# EAGLE schematic QTouchShield (EAGLE 6.2)
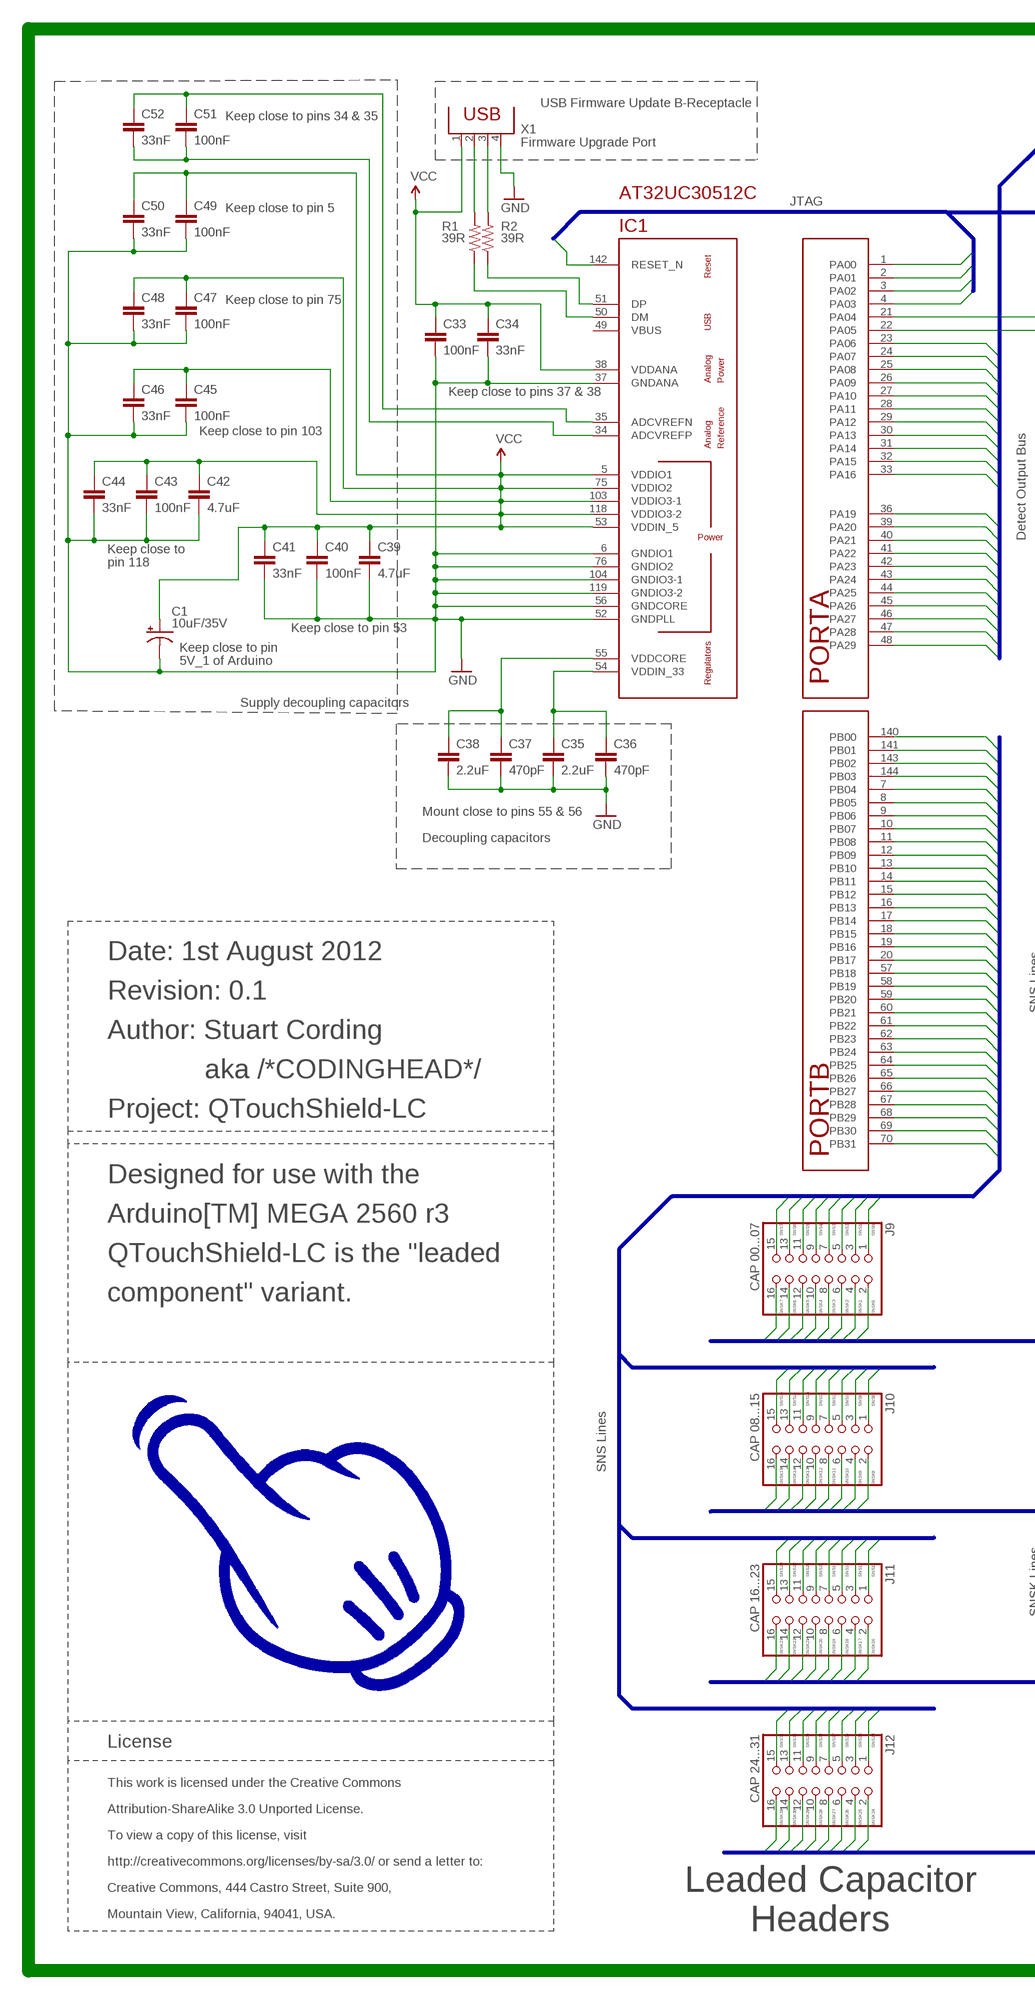
[diagram p0: schematic, sheet 1, part 1 of 2]
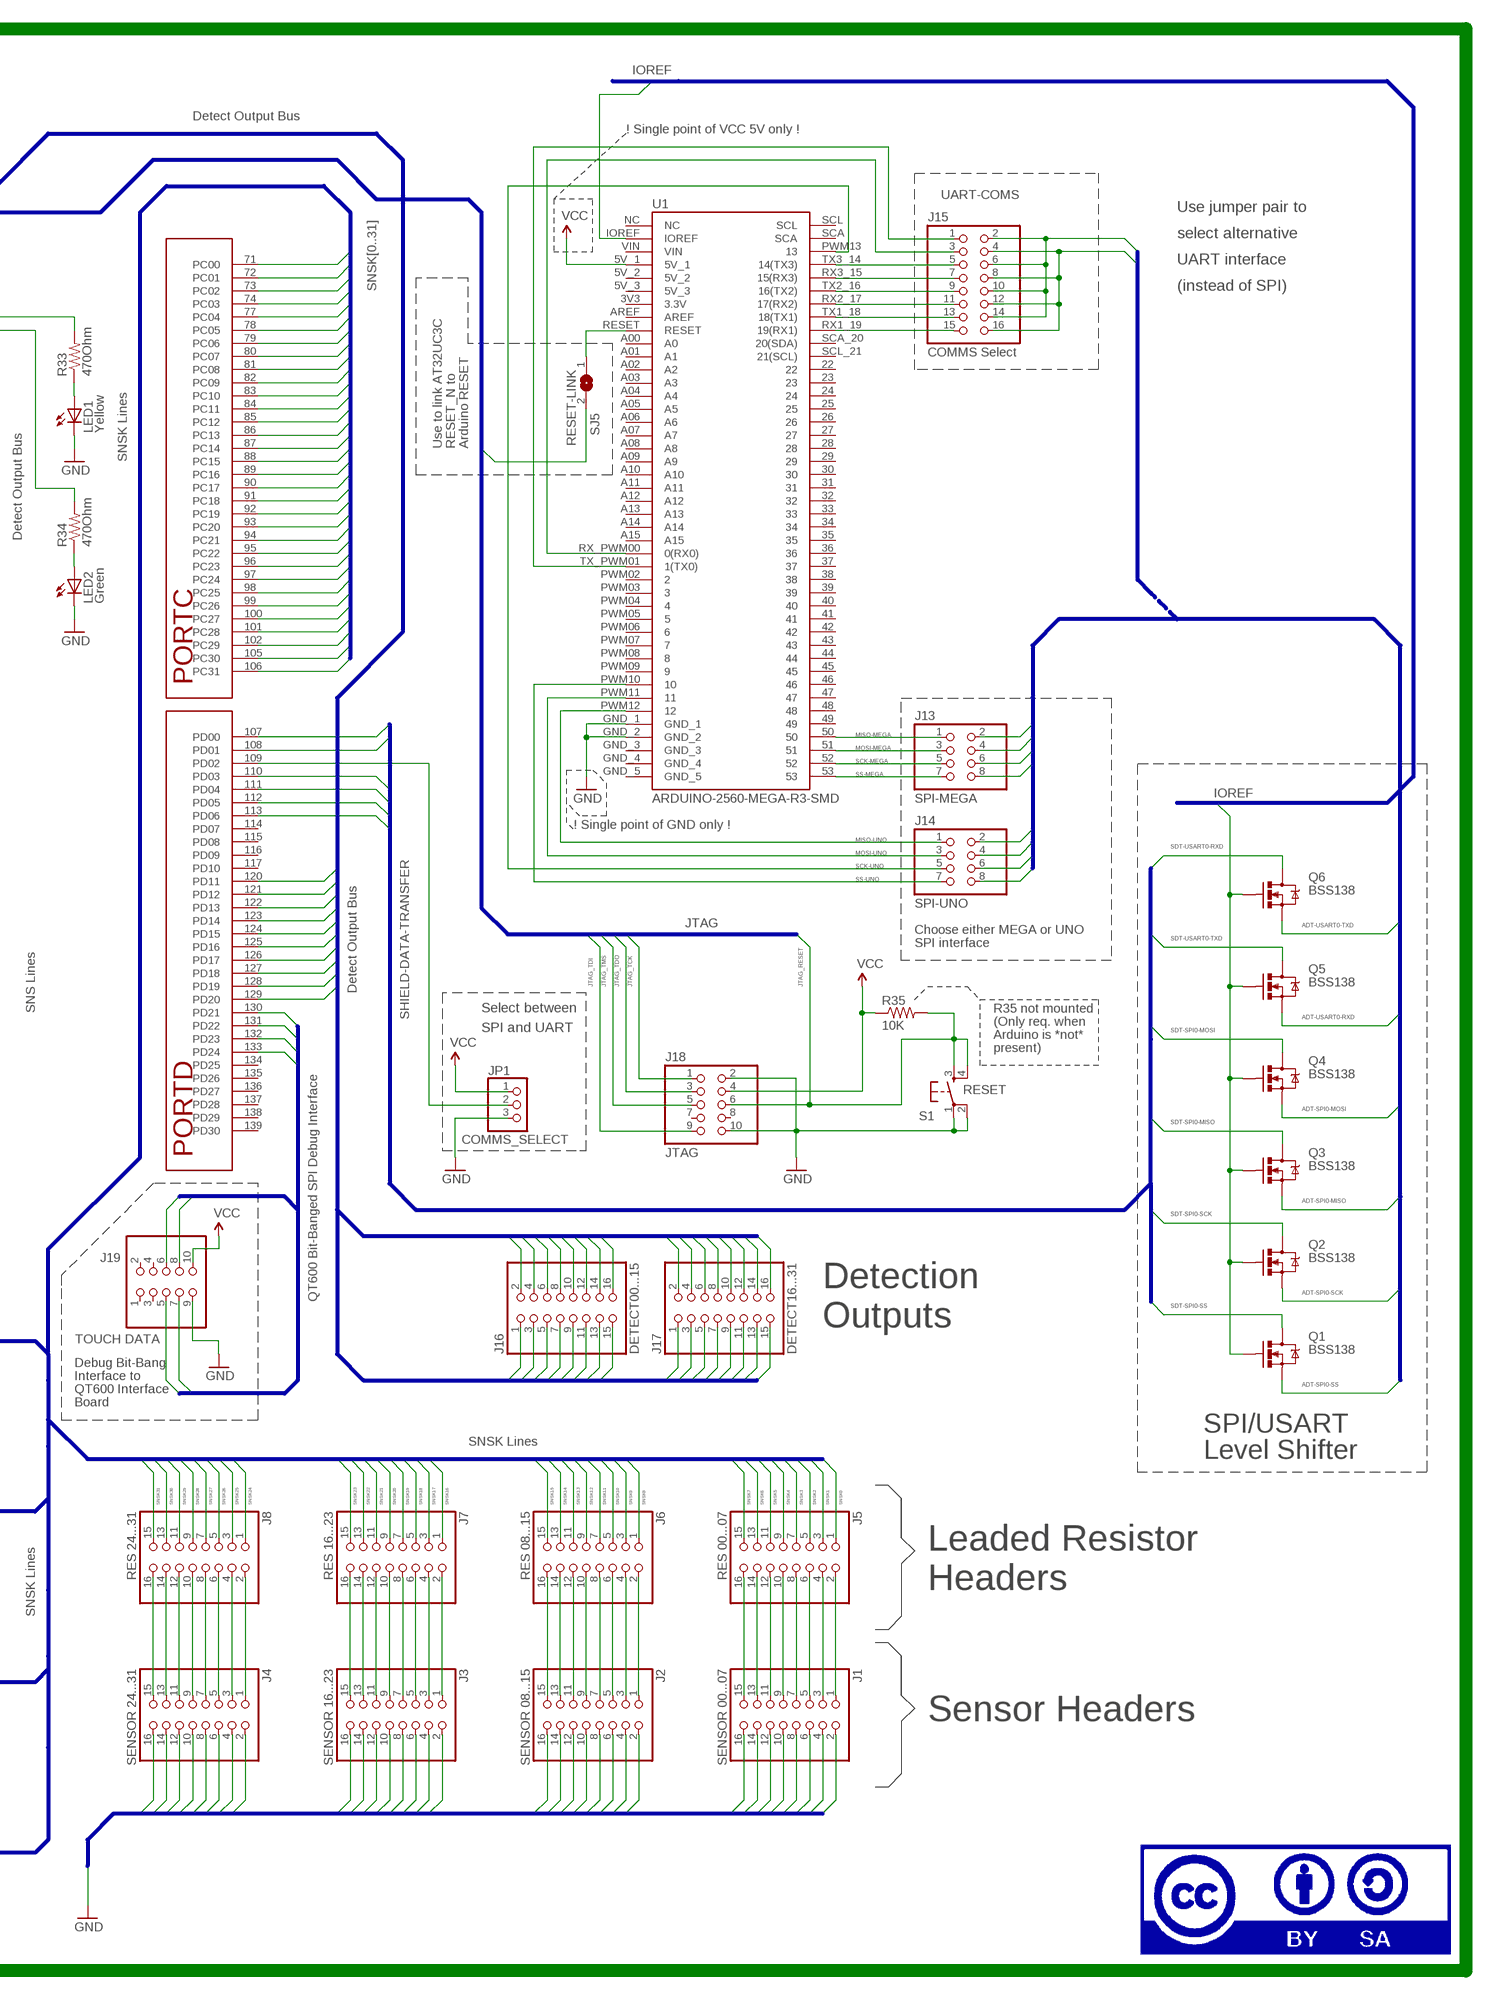
[diagram p1: schematic, sheet 1, part 2 of 2]

## Parts
C1  10uF/35V  CAP_POLC  [PANASONIC_C]
C33  100nF  CAP0805  [0805]
C34  33nF  CAP0805  [0805]
C35  2.2uF  CAP1210  [1210]
C36  470pF  CAP0805  [0805]
C37  470pF  CAP0805  [0805]
C38  2.2uF  CAP1210  [1210]
C39  4.7uF  CAP1210  [1210]
C40  100nF  CAP0805  [0805]
C41  33nF  CAP0805  [0805]
C42  4.7uF  CAP1210  [1210]
C43  100nF  CAP0805  [0805]
C44  33nF  CAP0805  [0805]
C45  100nF  CAP0805  [0805]
C46  33nF  CAP0805  [0805]
C47  100nF  CAP0805  [0805]
C48  33nF  CAP0805  [0805]
C49  100nF  CAP0805  [0805]
C50  33nF  CAP0805  [0805]
C51  100nF  CAP0805  [0805]
C52  33nF  CAP0805  [0805]
IC1  AT32UC3C0512CJEDEC-MS-026  [LQFP144]
J1  SENSOR 00...07  2X8-HEADERHARWIN-PIN-SMT  [2X8-V-MALE-SMT-HARWIN]
J2  SENSOR 08...15  2X8-HEADERHARWIN-PIN-SMT  [2X8-V-MALE-SMT-HARWIN]
J3  SENSOR 16...23  2X8-HEADERHARWIN-PIN-SMT  [2X8-V-MALE-SMT-HARWIN]
J4  SENSOR 24...31  2X8-HEADERHARWIN-PIN-SMT  [2X8-V-MALE-SMT-HARWIN]
J5  RES 00...07  2X8-HEADERHARWIN-RECEPTACLE-SMT  [2X8-V-FEMALE-SMT-HARWIN]
J6  RES 08...15  2X8-HEADERHARWIN-RECEPTACLE-SMT  [2X8-V-FEMALE-SMT-HARWIN]
J7  RES 16...23  2X8-HEADERHARWIN-RECEPTACLE-SMT  [2X8-V-FEMALE-SMT-HARWIN]
J8  RES 24...31  2X8-HEADERHARWIN-RECEPTACLE-SMT  [2X8-V-FEMALE-SMT-HARWIN]
J9  CAP 00...07  2X8-HEADERHARWIN-RECEPTACLE-SMT  [2X8-V-FEMALE-SMT-HARWIN]
J10  CAP 08...15  2X8-HEADERHARWIN-RECEPTACLE-SMT  [2X8-V-FEMALE-SMT-HARWIN]
J11  CAP 16...23  2X8-HEADERHARWIN-RECEPTACLE-SMT  [2X8-V-FEMALE-SMT-HARWIN]
J12  CAP 24...31  2X8-HEADERHARWIN-RECEPTACLE-SMT  [2X8-V-FEMALE-SMT-HARWIN]
J13  SPI-MEGA  2X4-HEADERSMT-MALE  [2X4-V-MALE-SMT-HARWIN]
J14  SPI-UNO  2X4-HEADERSMT-MALE  [2X4-V-MALE-SMT-HARWIN]
J15  COMMS Select  2X8-HEADERHARWIN-PIN-SMT  [2X8-V-MALE-SMT-HARWIN]
J16  DETECT00...15  2X8-HEADERHARWIN-PIN-SMT  [2X8-V-MALE-SMT-HARWIN]
J17  DETECT16...31  2X8-HEADERHARWIN-PIN-SMT  [2X8-V-MALE-SMT-HARWIN]
J18  JTAG  2X5-HEADERSMT  [2X5-V-MALE-SMT-HARWIN]
J19  TOUCH DATA  2X5-HEADERSMT  [2X5-V-MALE-SMT-HARWIN]
JP1  COMMS_SELECT  PINHD-1X3  [1X03]
LED1  Yellow  LED1206  [LED-1206]
LED2  Green  LED1206  [LED-1206]
Q1  BSS138  MOSFET-NCHANNELSMD  [SOT23-3]
Q2  BSS138  MOSFET-NCHANNELSMD  [SOT23-3]
Q3  BSS138  MOSFET-NCHANNELSMD  [SOT23-3]
Q4  BSS138  MOSFET-NCHANNELSMD  [SOT23-3]
Q5  BSS138  MOSFET-NCHANNELSMD  [SOT23-3]
Q6  BSS138  MOSFET-NCHANNELSMD  [SOT23-3]
R1  39R  RESISTOR0805-RES  [0805]
R2  39R  RESISTOR0805-RES  [0805]
R33  470Ohm  RESISTOR0805-RES  [0805]
R34  470Ohm  RESISTOR0805-RES  [0805]
R35  10K  RESISTOR0805-RES  [0805]
S1  RESET  TAC_SWITCHSMD  [TACTILE_SWITCH_SMD]
SJ5  RESET-LINK  SJ  [SJ]
U1  ARDUINO-2560-MEGA-R3-SMD  ARDUINO-2560-MEGA-R3SMDSMD-BOTTOM  [ARDUINO-2560-R3-SMD]
X1  Firmware Upgrade Port  PN87520  [PN87520]

## Nets
ADCVREFN: C51.1 C52.1 IC1.35(ADCVREFN)
ADCVREFP: C51.2 C52.2 IC1.34(ADCVREFP)
ADT-SPI0-MISO: J13.2 J14.2 Q3.2(S)
ADT-SPI0-MOSI: J13.4 J14.4 Q4.2(S)
ADT-SPI0-SCK: J13.6 J14.6 Q2.2(S)
ADT-SPI0-SS: J13.8 J14.8 Q1.2(S)
ADT-USART0-RXD: J15.4 J15.8 J15.12 J15.16 Q5.2(S)
ADT-USART0-TXD: J15.2 J15.6 J15.10 J15.14 Q6.2(S)
ARDUINO_RESET: SJ5.1 U1.RESET
GND: C1.- C33.2 C34.2 C35.2 C36.2 C37.2 C38.2 C39.2 C40.2 C41.2 C42.2 C43.2 C44.2 C45.2 C46.2 C47.2 C48.2 C49.2 C50.2 IC1.6(GNDIO1) IC1.37(GNDANA) IC1.52(GNDPLL) IC1.56(GNDCORE) IC1.76(GNDIO2) IC1.104(GNDIO3-1) IC1.119(GNDIO3-2) J1.2 J1.4 J1.6 J1.8 J1.10 J1.12 J1.14 J1.16 J2.2 J2.4 J2.6 J2.8 J2.10 J2.12 J2.14 J2.16 J3.2 J3.4 J3.6 J3.8 J3.10 J3.12 J3.14 J3.16 J4.2 J4.4 J4.6 J4.8 J4.10 J4.12 J4.14 J4.16 J18.2 J18.10 J19.9 JP1.3 LED1.C LED2.C S1.1 S1.2 U1.GND_1 U1.GND_2 X1.4
IOREF: Q1.1(G) Q2.1(G) Q3.1(G) Q4.1(G) Q5.1(G) Q6.1(G) U1.IOREF
JTAG_RESET: IC1.142(RESET_N) J18.6 R35.2 S1.3 S1.4 SJ5.2
JTAG_TCK: IC1.1(PA00) J18.1
JTAG_TDI: IC1.2(PA01) J18.9
JTAG_TDO: IC1.3(PA02) J18.3
JTAG_TMS: IC1.4(PA03) J18.5
MISO-MEGA: J13.1 U1.50
MISO-UNO: J14.1 U1.PWM12
MOSI-MEGA: J13.3 U1.51
MOSI-UNO: J14.3 U1.PWM11
N$1: LED1.A R33.1
N$2: J4.15 J8.16
N$3: J4.13 J8.14
N$4: J4.11 J8.12
N$5: J4.9 J8.10
N$6: J4.7 J8.8
N$7: J4.5 J8.6
N$8: J4.3 J8.4
N$9: J4.1 J8.2
N$10: J3.15 J7.16
N$11: J3.13 J7.14
N$12: J3.11 J7.12
N$13: J3.9 J7.10
N$14: J3.7 J7.8
N$15: J3.5 J7.6
N$16: J3.3 J7.4
N$17: J3.1 J7.2
N$18: J2.15 J6.16
N$19: J2.13 J6.14
N$20: J2.11 J6.12
N$21: J2.9 J6.10
N$22: J2.7 J6.8
N$23: J2.5 J6.6
N$24: J2.3 J6.4
N$25: J2.1 J6.2
N$26: J1.15 J5.16
N$27: J1.13 J5.14
N$28: J1.11 J5.12
N$29: J1.9 J5.10
N$30: J1.7 J5.8
N$31: J1.5 J5.6
N$32: J1.3 J5.4
N$33: J1.1 J5.2
N$34: R1.2 X1.2
N$35: R2.2 X1.3
N$42: LED2.A R34.1
QT-DETECT-GENERAL: IC1.21(PA04) R33.2
RX0: J15.3 U1.RX_PWM00(0(RX0))
RX1: J15.15 U1.RX1_19(19(RX1))
RX2: J15.11 U1.RX2_17(17(RX2))
RX3: J15.7 U1.RX3_15(15(RX3))
SCK-MEGA: J13.5 U1.52
SCK-UNO: J14.5 U1.PWM13
SDT-SPI0-MISO: IC1.112(PD05) Q3.3(D)
SDT-SPI0-MOSI: IC1.111(PD04) Q4.3(D)
SDT-SPI0-SCK: IC1.113(PD06) Q2.3(D)
SDT-SPI0-SS: IC1.110(PD03) Q1.3(D)
SDT-USART0-RXD: IC1.108(PD01) Q6.3(D)
SDT-USART0-TXD: IC1.107(PD00) Q5.3(D)
SHIELD-DATA-TRANSFER-COM-SELECT: IC1.109(PD02) JP1.2
SHIELD-DATA-TRANSFER-VISUAL-OUTPUT: IC1.22(PA05) R34.2
SHIELD-DETECT0: IC1.23(PA06) J16.1
SHIELD-DETECT1: IC1.24(PA07) J16.2
SHIELD-DETECT2: IC1.25(PA08) J16.3
SHIELD-DETECT3: IC1.26(PA09) J16.4
SHIELD-DETECT4: IC1.27(PA10) J16.5
SHIELD-DETECT5: IC1.28(PA11) J16.6
SHIELD-DETECT6: IC1.29(PA12) J16.7
SHIELD-DETECT7: IC1.30(PA13) J16.8
SHIELD-DETECT8: IC1.31(PA14) J16.9
SHIELD-DETECT9: IC1.32(PA15) J16.10
SHIELD-DETECT10: IC1.33(PA16) J16.11
SHIELD-DETECT11: IC1.36(PA19) J16.12
SHIELD-DETECT12: IC1.39(PA20) J16.13
SHIELD-DETECT13: IC1.40(PA21) J16.14
SHIELD-DETECT14: IC1.41(PA22) J16.15
SHIELD-DETECT15: IC1.42(PA23) J16.16
SHIELD-DETECT16: IC1.43(PA24) J17.15
SHIELD-DETECT17: IC1.44(PA25) J17.16
SHIELD-DETECT18: IC1.45(PA26) J17.13
SHIELD-DETECT19: IC1.46(PA27) J17.14
SHIELD-DETECT20: IC1.47(PA28) J17.11
SHIELD-DETECT21: IC1.48(PA29) J17.12
SHIELD-DETECT22: IC1.120(PD11) J17.9
SHIELD-DETECT23: IC1.121(PD12) J17.10
SHIELD-DETECT24: IC1.122(PD13) J17.7
SHIELD-DETECT25: IC1.123(PD14) J17.8
SHIELD-DETECT26: IC1.124(PD15) J17.5
SHIELD-DETECT27: IC1.125(PD16) J17.6
SHIELD-DETECT28: IC1.126(PD17) J17.3
SHIELD-DETECT29: IC1.127(PD18) J17.4
SHIELD-DETECT30: IC1.128(PD19) J17.1
SHIELD-DETECT31: IC1.129(PD20) J17.2
SNS0: IC1.140(PB00) J9.1
SNS1: IC1.141(PB01) J9.3
SNS2: IC1.143(PB02) J9.5
SNS3: IC1.144(PB03) J9.7
SNS4: IC1.7(PB04) J9.9
SNS5: IC1.8(PB05) J9.11
SNS6: IC1.9(PB06) J9.13
SNS7: IC1.10(PB07) J9.15
SNS8: IC1.11(PB08) J10.1
SNS9: IC1.12(PB09) J10.3
SNS10: IC1.13(PB10) J10.5
SNS11: IC1.14(PB11) J10.7
SNS12: IC1.15(PB12) J10.9
SNS13: IC1.16(PB13) J10.11
SNS14: IC1.17(PB14) J10.13
SNS15: IC1.18(PB15) J10.15
SNS16: IC1.19(PB16) J11.1
SNS17: IC1.20(PB17) J11.3
SNS18: IC1.57(PB18) J11.5
SNS19: IC1.58(PB19) J11.7
SNS20: IC1.59(PB20) J11.9
SNS21: IC1.60(PB21) J11.11
SNS22: IC1.61(PB22) J11.13
SNS23: IC1.62(PB23) J11.15
SNS24: IC1.63(PB24) J12.1
SNS25: IC1.64(PB25) J12.3
SNS26: IC1.65(PB26) J12.5
SNS27: IC1.66(PB27) J12.7
SNS28: IC1.67(PB28) J12.9
SNS29: IC1.68(PB29) J12.11
SNS30: IC1.69(PB30) J12.13
SNS31: IC1.70(PB31) J12.15
SNSK0: IC1.71(PC00) J5.1 J9.2
SNSK1: IC1.72(PC01) J5.3 J9.4
SNSK2: IC1.73(PC02) J5.5 J9.6
SNSK3: IC1.74(PC03) J5.7 J9.8
SNSK4: IC1.77(PC04) J5.9 J9.10
SNSK5: IC1.78(PC05) J5.11 J9.12
SNSK6: IC1.79(PC06) J5.13 J9.14
SNSK7: IC1.80(PC07) J5.15 J9.16
SNSK8: IC1.81(PC08) J6.1 J10.2
SNSK9: IC1.82(PC09) J6.3 J10.4
SNSK10: IC1.83(PC10) J6.5 J10.6
SNSK11: IC1.84(PC11) J6.7 J10.8
SNSK12: IC1.85(PC12) J6.9 J10.10
SNSK13: IC1.86(PC13) J6.11 J10.12
SNSK14: IC1.87(PC14) J6.13 J10.14
SNSK15: IC1.88(PC15) J6.15 J10.16
SNSK16: IC1.89(PC16) J7.1 J11.2
SNSK17: IC1.90(PC17) J7.3 J11.4
SNSK18: IC1.91(PC18) J7.5 J11.6
SNSK19: IC1.92(PC19) J7.7 J11.8
SNSK20: IC1.93(PC20) J7.9 J11.10
SNSK21: IC1.94(PC21) J7.11 J11.12
SNSK22: IC1.95(PC22) J7.13 J11.14
SNSK23: IC1.96(PC23) J7.15 J11.16
SNSK24: IC1.97(PC24) J8.1 J12.2
SNSK25: IC1.98(PC25) J8.3 J12.4
SNSK26: IC1.99(PC26) J8.5 J12.6
SNSK27: IC1.100(PC27) J8.7 J12.8
SNSK28: IC1.101(PC28) J8.9 J12.10
SNSK29: IC1.102(PC29) J8.11 J12.12
SNSK30: IC1.105(PC30) J8.13 J12.14
SNSK31: IC1.106(PC31) J8.15 J12.16
SS-MEGA: J13.7 U1.53
SS-UNO: J14.7 U1.PWM10
TOUCH_DATA-MISO: IC1.133(PD24) J19.7
TOUCH_DATA-MOSI: IC1.132(PD23) J19.6
TOUCH_DATA-SCK: IC1.131(PD22) J19.8
TOUCH_DATA-SS: IC1.130(PD21) J19.5
TX0: J15.1 U1.TX_PWM01(1(TX0))
TX1: J15.13 U1.TX1_18(18(TX1))
TX2: J15.9 U1.TX2_16(16(TX2))
TX3: J15.5 U1.TX3_14(14(TX3))
USB-DM: IC1.50(DM) R1.1
USB-DP: IC1.51(DP) R2.1
VCC: C1.+ C33.1 C34.1 C39.1 C40.1 C41.1 C42.1 C43.1 C44.1 C45.1 C46.1 C47.1 C48.1 C49.1 C50.1 IC1.5(VDDIO1) IC1.38(VDDANA) IC1.53(VDDIN_5) IC1.75(VDDIO2) IC1.103(VDDIO3-1) IC1.118(VDDIO3-2) J18.4 J19.10 JP1.1 R35.1 U1.5V_1 X1.1
VDDCORE: C37.1 C38.1 IC1.55(VDDCORE)
VDDIN_33: C35.1 C36.1 IC1.54(VDDIN_33)
Unconnected: IC1.49(VBUS) IC1.114(PD07) IC1.115(PD08) IC1.116(PD09) IC1.117(PD10) IC1.134(PD25) IC1.135(PD26) IC1.136(PD27) IC1.137(PD28) IC1.138(PD29) IC1.139(PD30) J18.7 J18.8 J19.1 J19.2 J19.3 J19.4 U1.3V3(3.3V) U1.5V_2 U1.5V_3 U1.22 U1.23 U1.24 U1.25 U1.26 U1.27 U1.28 U1.29 U1.30 U1.31 U1.32 U1.33 U1.34 U1.35 U1.36 U1.37 U1.38 U1.39 U1.40 U1.41 U1.42 U1.43 U1.44 U1.45 U1.46 U1.47 U1.48 U1.49 U1.A00(A0) U1.A01(A1) U1.A02(A2) U1.A03(A3) U1.A04(A4) U1.A05(A5) U1.A06(A6) U1.A07(A7) U1.A08(A8) U1.A09(A9) U1.A10 U1.A11 U1.A12 U1.A13 U1.A14 U1.A15 U1.AREF U1.GND_3 U1.GND_4 U1.GND_5 U1.NC U1.PWM02 U1.PWM03 U1.PWM04 U1.PWM05 U1.PWM06 U1.PWM07 U1.PWM08 U1.PWM09 U1.SCA U1.SCA_20(20(SDA)) U1.SCL U1.SCL_21(21(SCL)) U1.VIN

## Buses
SNS[0..31]
SNSK[0..31]
GND
JTAG_TCK,JTAG_TDI,JTAG_TDO,JTAG_TMS,JTAG_RESET
SHIELD-DETECT[0..31]
SDT-USART0-TXD,SDT-USART0-RXD,SDT-SPI0-SS,SDT-SPI0-MOSI,SDT-SPI0-MISO,SDT-SPI0-SCK
TOUCH_DATA-SS,TOUCH_DATA-SCK,TOUCH_DATA-MOSI,TOUCH_DATA-MISO
IOREF
ADT-USART0-TXD,ADT-USART0-RXD,ADT-SPI0-SS,ADT-SPI0-MOSI,ADT-SPI0-MISO,ADT-SPI0-SCK

## Notes on the sheet
- USB Firmware Update B-Receptacle
- Keep close to pins 34 & 35 | Detect Output Bus
- ! Single point of VCC 5V only !
- UART-COMS
- JTAG
- Keep close to pin 5 | Use jumper pair to
- select alternative
- UART interface
- (instead of SPI)
- Keep close to pin 75
- Keep close to pins 37 & 38
- Keep close to pin 103
- Use to link AT32UC3C | RESET_N to | Arduino RESET
- SNSK Lines
- Detect Output Bus
- Keep close to
- pin 118
- Keep close to pin 53
- Keep close to pin
- 5V_1 of Arduino
- Supply decoupling capacitors
- Mount close to pins 55 & 56
- ! Single point of GND only !
- Decoupling capacitors
- JTAG
- Choose either MEGA or UNO
- SPI interface
- Date: 1st August 2012
- Detect Output Bus
- Revision: 0.1
- SNS Lines | Select between | R35 not mounted
- SHIELD-DATA-TRANSFER
- (Only req. when
- SPI and UART
- Author: Stuart Cording | Arduino is *not*
- present)
- aka /*CODINGHEAD*/
- Project: QTouchShield-LC
- Designed for use with the
- Arduino[TM] MEGA 2560 r3
- QTouchShield-LC is the "leaded
- Detection
- component" variant. | QT600 Bit-Banged SPI Debug Interface
- Outputs
- Debug Bit-Bang
- Interface to
- QT600 Interface
- Board
- SPI/USART
- SNSK Lines
- Level Shifter
- SNS Lines
- Leaded Resistor
- Headers
- SNSK Lines
- Sensor Headers
- License
- This work is licensed under the Creative Commons
- Attribution-ShareAlike 3.0 Unported License.
- To view a copy of this license, visit
- http://creativecommons.org/licenses/by-sa/3.0/ or send a letter to:
- Creative Commons, 444 Castro Street, Suite 900, | Leaded Capacitor
- Mountain View, California, 94041, USA.
- Headers

## Library data of the parts
C1 = SparkFun:CAP_POL: Capacitor Polarized These are standard SMD and PTH capacitors. Normally 10uF, 47uF, and 100uF in electrolytic and tantalum varieties. Always verify the external diameter of the through hole cap, it varies with capacity, voltage, and manufacturer. The EIA devices should be standard.
C33-C52 = SparkFun:CAP: Capacitor Standard 0603 ceramic capacitor, and 0.1" leaded capacitor.
IC1 = atmel-AVR32:AT32UC3C0512C: AT32UC3C0512C - AVR32 Microcontroller from Atmel
J1-J12 J15-J17 = codinghead:2X8-HEADER: 2x8 Header
J13 J14 = codinghead:2X4-HEADER
J18 J19 = codinghead:2X5-HEADER
JP1 = pinhead:PINHD-1X3: PIN HEADER
LED1 LED2 = SparkFun:LED: LEDs Standard schematic elements and footprints for 5mm, 3mm, 1206, and 0603 sized LEDs. 5mm - Spark Fun Electronics SKU : COM-00529 (and others)
Q1-Q6 = SparkFun:MOSFET-NCHANNEL
R1 R2 R33-R35 = SparkFun:RESISTOR: Resistor Basic schematic elements and footprints for 0603, 1206, and PTH resistors.
S1 = SparkFun:TAC_SWITCH: Momentary Switch Button commonly used for reset or general input. Spark Fun Electronics SKU : COM-00097
SJ5 = jumper:SJ: SMD solder JUMPER
U1 = codinghead:ARDUINO-2560-MEGA-R3
X1 = con-berg:PN87520: BERG USB connector; OC_FARNELL: unknown; OC_NEWARK: unknown